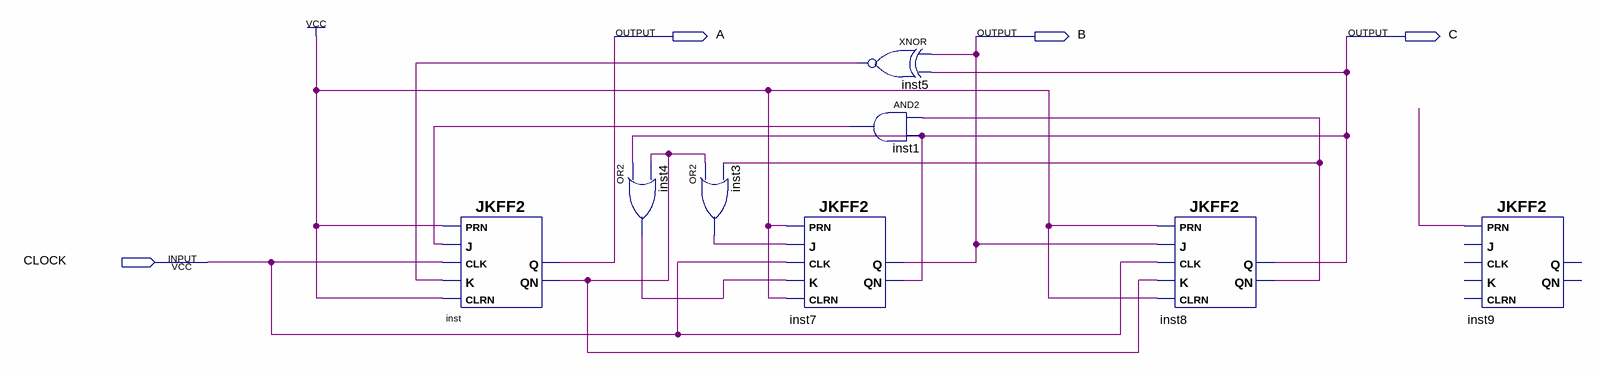
[diagram p0: schematic sheet]
// Quartus schematic ex2-lista4.bdf as structural Verilog: 8 symbols, 4 pins
module \ex2-lista4  (
  input  CLOCK,
  output A,
  output B,
  output C
);

  wire inst1_out, inst3_out, inst4_out, inst5_out, inst8_qn, inst_qn, undriven;

  JKFF2 inst (.K(inst5_out), .CLRN(1'b1), .CLK(CLOCK), .PRN(1'b1), .J(inst1_out), .QN(inst_qn), .Q(A));
  or inst4 (inst4_out, C, inst_qn);
  or inst3 (inst3_out, inst_qn, inst8_qn);
  JKFF2 inst7 (.K(inst4_out), .CLRN(1'b1), .CLK(CLOCK), .PRN(1'b1), .J(inst3_out), .QN(C), .Q(B));
  xnor inst5 (inst5_out, B, C);
  and inst1 (inst1_out, inst8_qn, C);
  JKFF2 inst8 (.K(inst_qn), .CLRN(1'b1), .CLK(CLOCK), .PRN(1'b1), .J(B), .QN(inst8_qn), .Q(C));
  JKFF2 inst9 (.PRN(undriven));  // open: K, CLRN, CLK, J, QN, Q
endmodule
